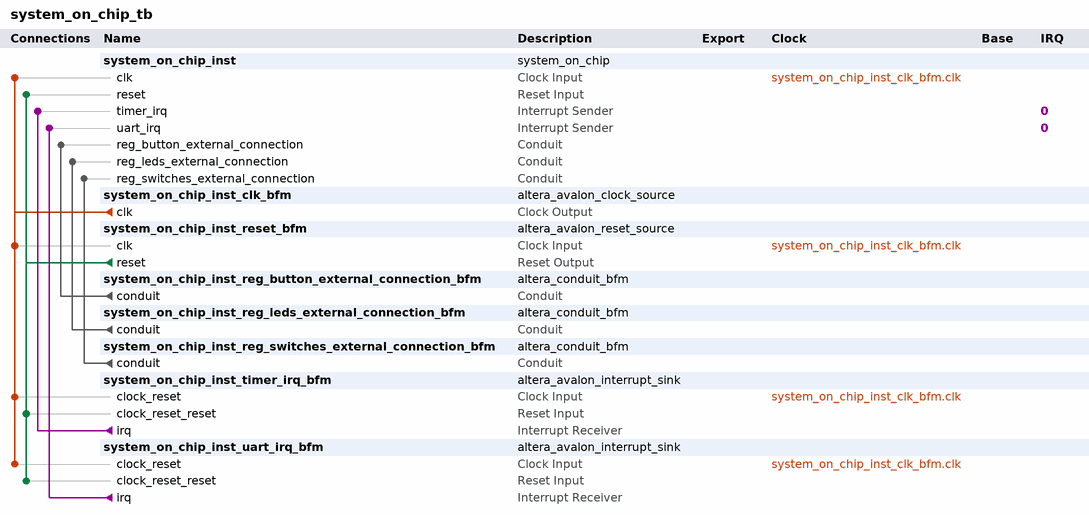
[diagram p0: system contents]
# Platform Designer (Qsys) system system_on_chip_tb, Cyclone V 5CSEMA5F31C6
# Parameters at their usual value, and those the tool derives, are not listed.
package require -exact qsys 18.0
create_system system_on_chip_tb
set_project_property DEVICE_FAMILY {Cyclone V}
set_project_property DEVICE 5CSEMA5F31C6

add_instance system_on_chip_inst system_on_chip 1.0

add_instance system_on_chip_inst_clk_bfm altera_avalon_clock_source 18.0

add_instance system_on_chip_inst_reset_bfm altera_avalon_reset_source 18.0
set_instance_parameter_value system_on_chip_inst_reset_bfm ASSERT_HIGH_RESET 0
set_instance_parameter_value system_on_chip_inst_reset_bfm INITIAL_RESET_CYCLES 50

add_instance system_on_chip_inst_reg_button_external_connection_bfm altera_conduit_bfm 18.0
set_instance_parameter_value system_on_chip_inst_reg_button_external_connection_bfm CLOCKED_SIGNAL false
set_instance_parameter_value system_on_chip_inst_reg_button_external_connection_bfm ENABLE_RESET false
set_instance_parameter_value system_on_chip_inst_reg_button_external_connection_bfm SIGNAL_DIRECTIONS output
set_instance_parameter_value system_on_chip_inst_reg_button_external_connection_bfm SIGNAL_WIDTHS 8

add_instance system_on_chip_inst_reg_leds_external_connection_bfm altera_conduit_bfm 18.0
set_instance_parameter_value system_on_chip_inst_reg_leds_external_connection_bfm CLOCKED_SIGNAL false
set_instance_parameter_value system_on_chip_inst_reg_leds_external_connection_bfm ENABLE_RESET false
set_instance_parameter_value system_on_chip_inst_reg_leds_external_connection_bfm SIGNAL_DIRECTIONS input
set_instance_parameter_value system_on_chip_inst_reg_leds_external_connection_bfm SIGNAL_WIDTHS 32

add_instance system_on_chip_inst_reg_switches_external_connection_bfm altera_conduit_bfm 18.0
set_instance_parameter_value system_on_chip_inst_reg_switches_external_connection_bfm CLOCKED_SIGNAL false
set_instance_parameter_value system_on_chip_inst_reg_switches_external_connection_bfm ENABLE_RESET false
set_instance_parameter_value system_on_chip_inst_reg_switches_external_connection_bfm SIGNAL_DIRECTIONS input
set_instance_parameter_value system_on_chip_inst_reg_switches_external_connection_bfm SIGNAL_WIDTHS 10

add_instance system_on_chip_inst_timer_irq_bfm altera_avalon_interrupt_sink 18.0
set_instance_parameter_value system_on_chip_inst_timer_irq_bfm ASSERT_HIGH_IRQ 1
set_instance_parameter_value system_on_chip_inst_timer_irq_bfm ASYNCHRONOUS_INTERRUPT 0
set_instance_parameter_value system_on_chip_inst_timer_irq_bfm AV_IRQ_W 1
set_instance_parameter_value system_on_chip_inst_timer_irq_bfm VHDL_ID 0

add_instance system_on_chip_inst_uart_irq_bfm altera_avalon_interrupt_sink 18.0
set_instance_parameter_value system_on_chip_inst_uart_irq_bfm ASSERT_HIGH_IRQ 1
set_instance_parameter_value system_on_chip_inst_uart_irq_bfm ASYNCHRONOUS_INTERRUPT 0
set_instance_parameter_value system_on_chip_inst_uart_irq_bfm AV_IRQ_W 1
set_instance_parameter_value system_on_chip_inst_uart_irq_bfm VHDL_ID 1

# connections
add_connection system_on_chip_inst_clk_bfm.clk system_on_chip_inst.clk clock
add_connection system_on_chip_inst_clk_bfm.clk system_on_chip_inst_reset_bfm.clk clock
add_connection system_on_chip_inst_clk_bfm.clk system_on_chip_inst_timer_irq_bfm.clock_reset clock
add_connection system_on_chip_inst_clk_bfm.clk system_on_chip_inst_uart_irq_bfm.clock_reset clock
add_connection system_on_chip_inst_reset_bfm.reset system_on_chip_inst.reset reset
add_connection system_on_chip_inst_reset_bfm.reset system_on_chip_inst_timer_irq_bfm.clock_reset_reset reset
add_connection system_on_chip_inst_reset_bfm.reset system_on_chip_inst_uart_irq_bfm.clock_reset_reset reset
add_connection system_on_chip_inst_reg_button_external_connection_bfm.conduit system_on_chip_inst.reg_button_external_connection conduit
add_connection system_on_chip_inst_reg_leds_external_connection_bfm.conduit system_on_chip_inst.reg_leds_external_connection conduit
add_connection system_on_chip_inst_reg_switches_external_connection_bfm.conduit system_on_chip_inst.reg_switches_external_connection conduit
add_connection system_on_chip_inst_timer_irq_bfm.irq system_on_chip_inst.timer_irq interrupt
set_connection_parameter_value system_on_chip_inst_timer_irq_bfm.irq/system_on_chip_inst.timer_irq irqNumber 0
add_connection system_on_chip_inst_uart_irq_bfm.irq system_on_chip_inst.uart_irq interrupt
set_connection_parameter_value system_on_chip_inst_uart_irq_bfm.irq/system_on_chip_inst.uart_irq irqNumber 0

set_interconnect_requirement {$system} qsys_mm.clockCrossingAdapter HANDSHAKE
set_interconnect_requirement {$system} qsys_mm.enableEccProtection FALSE
set_interconnect_requirement {$system} qsys_mm.insertDefaultSlave FALSE
set_interconnect_requirement {$system} qsys_mm.maxAdditionalLatency 1

save_system system_on_chip_tb.qsys
